# EAGLE schematic remote control (EAGLE 7.3.0)
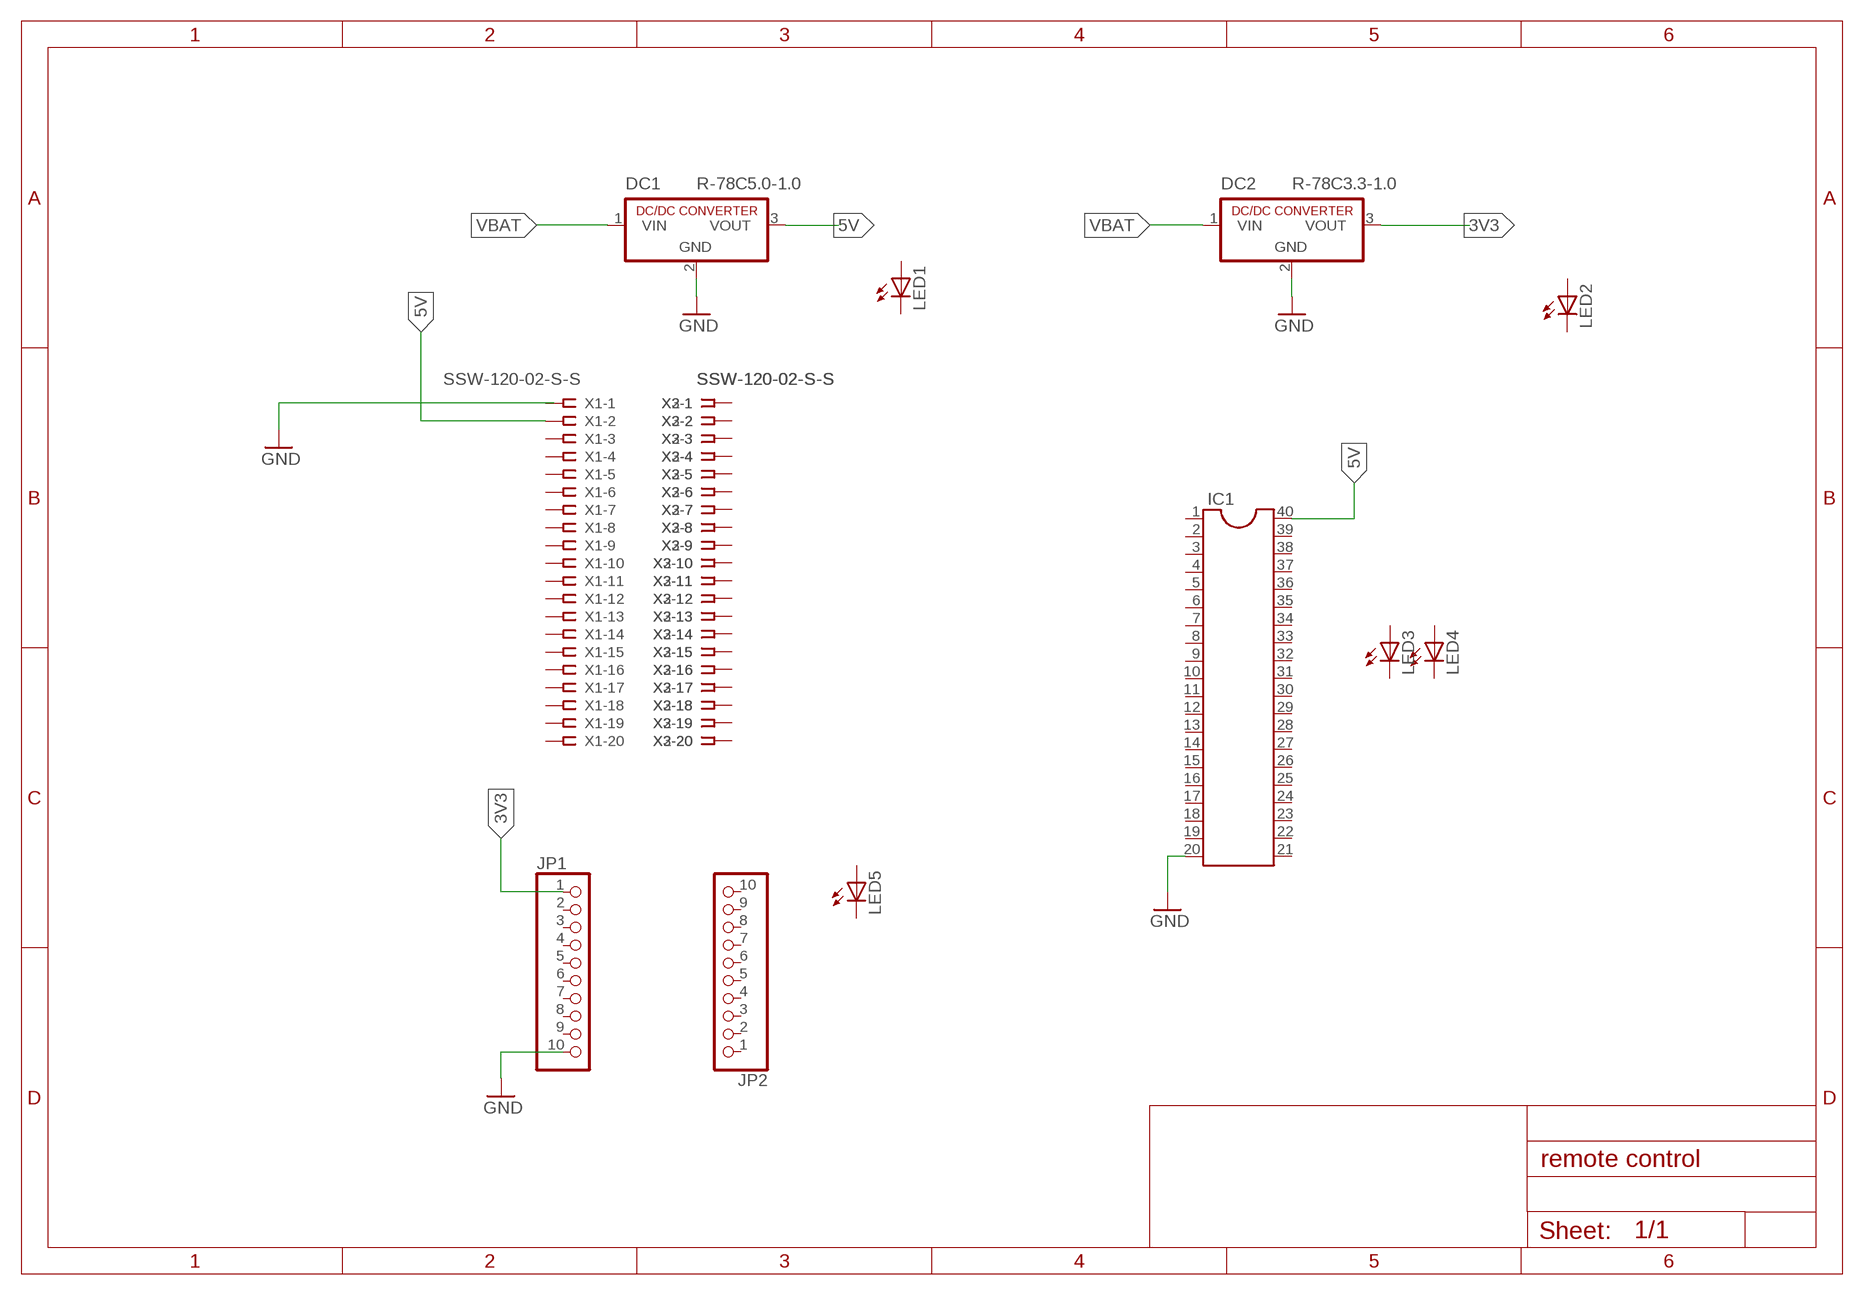
[diagram p0: schematic, sheet 1]

## Parts
DC1  R-78C5.0-1.0  [SIP3]
DC2  R-78C3.3-1.0  [SIP3]
IC1  DIL40  [DIL40]
JP1  PINHD-1X10M  [1X10M]
JP2  PINHD-1X10M  [1X10M]
LED1  LEDP-LCC-2  [P-LCC-2]
LED2  LEDP-LCC-2  [P-LCC-2]
LED3  LEDP-LCC-2  [P-LCC-2]
LED4  LEDP-LCC-2  [P-LCC-2]
LED5  LEDP-LCC-2  [P-LCC-2]
X1  SSW-120-02-S-S  [SSW-120-02-S-S]
X2  SSW-120-02-S-S  [SSW-120-02-S-S]
X3  SSW-120-02-S-S  [SSW-120-02-S-S]

## Nets
3V3: DC2.3(VOUT) JP1.1
5V: DC1.3(VOUT) IC1.40 X1.2
GND: DC1.2(GND) DC2.2(GND) IC1.20 JP1.10
N$1: X2.1 X3.1
N$2: X2.2 X3.2
N$3: X2.3 X3.3
N$4: X2.4 X3.4
N$5: X2.5 X3.5
N$6: X2.6 X3.6
N$7: X2.7 X3.7
N$8: X2.8 X3.8
N$9: X2.9 X3.9
N$10: X2.10 X3.10
N$11: X2.11 X3.11
N$12: X2.12 X3.12
N$13: X2.13 X3.13
N$14: X2.14 X3.14
N$15: X2.15 X3.15
N$16: X2.16 X3.16
N$17: X2.17 X3.17
N$18: X2.18 X3.18
N$19: X2.19 X3.19
N$20: X2.20 X3.20
VBAT: DC1.1(VIN) DC2.1(VIN)
Unconnected: IC1.1 IC1.2 IC1.3 IC1.4 IC1.5 IC1.6 IC1.7 IC1.8 IC1.9 IC1.10 IC1.11 IC1.12 IC1.13 IC1.14 IC1.15 IC1.16 IC1.17 IC1.18 IC1.19 IC1.21 IC1.22 IC1.23 IC1.24 IC1.25 IC1.26 IC1.27 IC1.28 IC1.29 IC1.30 IC1.31 IC1.32 IC1.33 IC1.34 IC1.35 IC1.36 IC1.37 IC1.38 IC1.39 JP1.2 JP1.3 JP1.4 JP1.5 JP1.6 JP1.7 JP1.8 JP1.9 JP2.1 JP2.2 JP2.3 JP2.4 JP2.5 JP2.6 JP2.7 JP2.8 JP2.9 JP2.10 LED1.A LED1.C LED2.A LED2.C LED3.A LED3.C LED4.A LED4.C LED5.A LED5.C X1.1 X1.3 X1.4 X1.5 X1.6 X1.7 X1.8 X1.9 X1.10 X1.11 X1.12 X1.13 X1.14 X1.15 X1.16 X1.17 X1.18 X1.19 X1.20

## Library data of the parts
DC1 DC2 = dc-dc-converter:R-78C*-1.0: INNOLINE DC/DC-Converter 1.0 AMP SIP3 Single Output Source: Data sheet <http://www.mikrocontroller.net/attachment/150645/157764-da-01-en-DC_DC_WANDLER_R_78C5_0_1_0.pdf>
IC1 = ic-package:DIL40: Dual In Line
JP1 JP2 = pinhead:PINHD-1X10: PIN HEADER
LED1-LED5 = led:LED: LED OSRAM: - CHIPLED LG R971, LG N971, LY N971, LG Q971, LY Q971, LO R971, LY R971 LH N974, LH R974 LS Q976, LO Q976, LY Q976 LO Q996 - Hyper CHIPLED LW Q18S LB Q993, LB Q99A, LB R99A - SideLED LS A670, LO A670, LY A670, LG A670, LP A670 LB A673, LV A673, LT A673, LW A673 LH A674 LY A675 LS A676, LA A676, LO A676, LY A676, LW A676 LS A679, LY A679, LG A679 - Hyper Micro SIDELED® LS Y876, LA Y876, LO Y876, LY Y876 LT Y87S - SmartLED LW L88C, LW L88S LB L89C, LB L89S, LG L890 LS L89K, LO L89K, LY L89K LS L896, LA L896, LO L896, LY L896 - TOPLED LS T670, LO T670, LY T670, LG T670, LP T670 LSG T670, LSP T670, LSY T670, LOP T670, LYG T670 LG T671, LOG T671, LSG T671 LB T673, LV T673, LT T673, LW T673 LH T674 LS T676, LA T676, LO T676, LY T676, LB T676, LH T676, LSB T676, LW T676 LB T67C, LV T67C, LT T67C, LS T67K, LO T67K, LY T67K, LW E67C LS E67B, LA E67B, LO E67B, LY E67B, LB E67C, LV E67C, LT E67C LW T67C LS T679, LY T679, LG T679 LS T770, LO T770, LY T770, LG T770, LP T770 LB T773, LV T773, LT T773, LW T773 LH T774 LS E675, LA E675, LY E675, LS T675 LS T776, LA T776, LO T776, LY T776, LB T776 LHGB T686 LT T68C, LB T68C - Hyper Mini TOPLED® LB M676 - Mini TOPLED Santana® LG M470 LS M47K, LO M47K, LY M47K Source: http://www.osram.convergy.de LUXEON: - LUMILED® LXK2-PW12-R00, LXK2-PW12-S00, LXK2-PW14-U00, LXK2-PW14-V00 LXK2-PM12-R00, LXK2-PM12-S00, LXK2-PM14-U00 LXK2-PE12-Q00, LXK2-PE12-R00, LXK2-PE12-S00, LXK2-PE14-T00, LXK2-PE14-U00 LXK2-PB12-K00, LXK2-PB12-L00, LXK2-PB12-M00, LXK2-PB14-N00, LXK2-PB14-P00, LXK2-PB14-Q00 LXK2-PR12-L00, LXK2-PR12-M00, LXK2-PR14-Q00, LXK2-PR14-R00 LXK2-PD12-Q00, LXK2-PD12-R00, LXK2-PD12-S00 LXK2-PH12-R00, LXK2-PH12-S00 LXK2-PL12-P00, LXK2-PL12-Q00, LXK2-PL12-R00 Source: www.luxeon.com KINGBRIGHT: KA-3528ASYC Source: www.kingbright.com
X1-X3 = con-samtec:SSW-120-02-S-S: THROUGH-HOLE .025" SQ POST SOCKET Source: Samtec SSW.pdf; MPN: SSW-120-02-S-S; OC_FARNELL: unknown; OC_NEWARK: 11P9641